# Altium schematic sheet Power Distribution - Front Enclosure.SchDoc: Outputs to Front Enclosure
size Letter; Organization: Midnight Sun Solar Rayce Car Team; Address1: University of Waterloo; Address2: 200 University Ave W; Address3: Waterloo, ON, Canada; Address4: N2L 3E9; DocumentNumber: 6; SheetNumber: 6; SheetTotal: 10; Website: www.uwmidsun.com
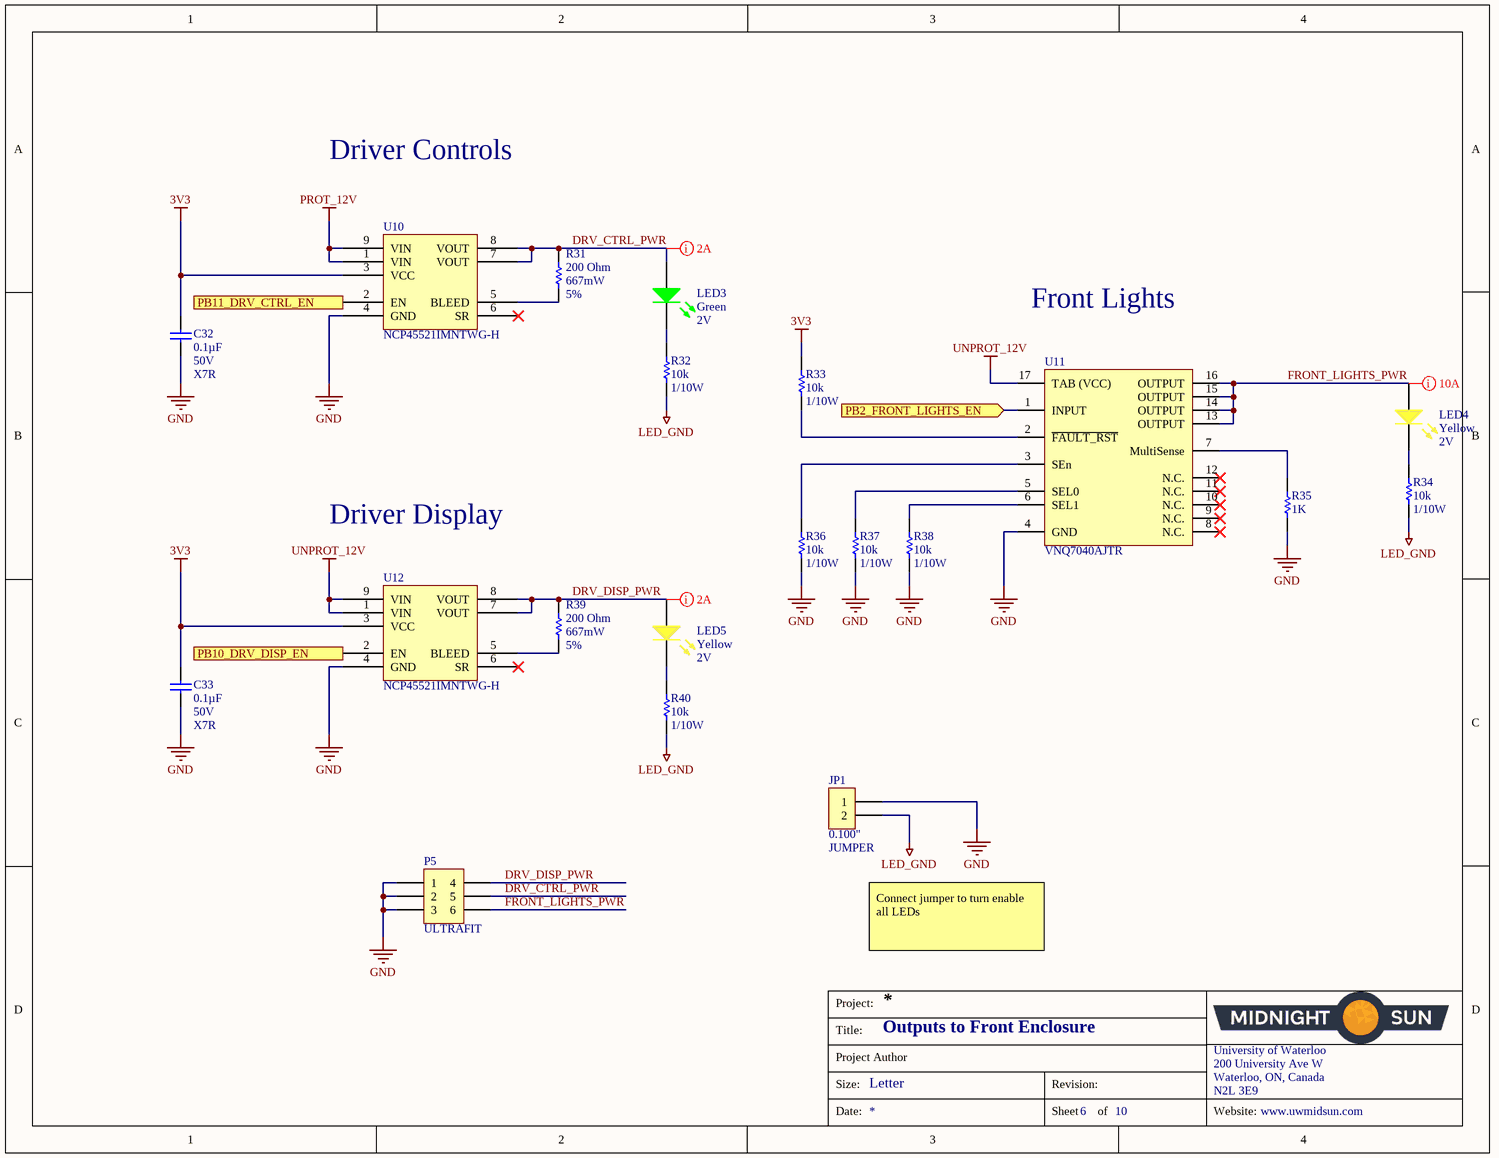
[diagram p0: Power Distribution - Front Enclosure.SchDoc]

## Parts
C32  Capacitance: 0.1µF  Voltage: 50V  Temperature Coefficient: X7R  [CAP, 0603]  (hidden comment: CAP CER 0.1UF 50V 10% X7R 0603)
C33  Capacitance: 0.1µF  Voltage: 50V  Temperature Coefficient: X7R  [CAP, 0603]  (hidden comment: CAP CER 0.1UF 50V 10% X7R 0603)
JP1  Row Spacing - Mating: 0.100"  [CONN 2POS JUMPER 0.1"]  (hidden comment: JUMPER)
LED3  Color: Green  Voltage - Forward (Vf) (Typ): 2V  [LED_0603]  (hidden comment: LED GREEN CLEAR 2V 0603)
LED4  Color: Yellow  Voltage - Forward (Vf) (Typ): 2V  [LED_0603]  (hidden comment: LED YELLOW CLEAR 2.1V 0603)
LED5  Color: Yellow  Voltage - Forward (Vf) (Typ): 2V  [LED_0603]  (hidden comment: LED YELLOW CLEAR 2.1V 0603)
P5  Series: ULTRAFIT  [CONN, 6POS ULTRA-FIT]  (hidden comment: CONN 6POS ULTRA-FIT 0.138")
R31  200 Ohm  Tolerance: 5%  Max Power Dissipation: 667mW  [RES 1206]
R32  Resistance: 10k  Power: 1/10W  [RES, 0603]  (hidden comment: RES 10K OHM 1% 1/10W 0603)
R33  Resistance: 10k  Power: 1/10W  [RES, 0603]  (hidden comment: RES 10K OHM 1% 1/10W 0603)
R34  Resistance: 10k  Power: 1/10W  [RES, 0603]  (hidden comment: RES 10K OHM 1% 1/10W 0603)
R35  1K  [RES, 0603]
R36  Resistance: 10k  Power: 1/10W  [RES, 0603]  (hidden comment: RES 10K OHM 1% 1/10W 0603)
R37  Resistance: 10k  Power: 1/10W  [RES, 0603]  (hidden comment: RES 10K OHM 1% 1/10W 0603)
R38  Resistance: 10k  Power: 1/10W  [RES, 0603]  (hidden comment: RES 10K OHM 1% 1/10W 0603)
R39  200 Ohm  Tolerance: 5%  Max Power Dissipation: 667mW  [RES 1206]
R40  Resistance: 10k  Power: 1/10W  [RES, 0603]  (hidden comment: RES 10K OHM 1% 1/10W 0603)
U10  IC LOAD SWITCH ACT-HI 10.5A 8DFN  [IC LOAD SWITCH ACT-HI 10.5A 8DFN]  (value not drawn)
U11  VNQ7040AJTR  [IC DVR HIGH-SIDE 1CH POWERSSO-16]
U12  IC LOAD SWITCH ACT-HI 10.5A 8DFN  [IC LOAD SWITCH ACT-HI 10.5A 8DFN]  (value not drawn)

## Ports
PB2_FRONT_LIGHTS_EN (in), PB10_DRV_DISP_EN (in), PB11_DRV_CTRL_EN (in)

## Nets
3V3: C32.1 C33.1 R33.1 U10.3(VCC) U12.3(VCC)
GND: C32.2 C33.2 JP1.1 P5.1 P5.2 P5.3 R35.2 R36.2 R37.2 R38.2 U10.4(GND) U11.4(GND) U12.4(GND)
LED_GND: JP1.2 R32.2 R34.2 R40.2
PROT_12V: U10.1(VIN) U10.9(VIN)
UNPROT_12V: U11.17(TAB_(VCC)) U12.1(VIN) U12.9(VIN)
DRV_CTRL_PWR: LED3.1(A) P5.5 R31.1 U10.7(VOUT) U10.8(VOUT)
DRV_DISP_PWR: LED5.1(A) P5.4 R39.1 U12.7(VOUT) U12.8(VOUT)
FRONT_LIGHTS_PWR: LED4.1(A) P5.6 U11.13(OUTPUT) U11.14(OUTPUT) U11.15(OUTPUT) U11.16(OUTPUT)
PB2_FRONT_LIGHTS_EN: U11.1(INPUT) ; port PB2_FRONT_LIGHTS_EN
PB10_DRV_DISP_EN: U12.2(EN) ; port PB10_DRV_DISP_EN
PB11_DRV_CTRL_EN: U10.2(EN) ; port PB11_DRV_CTRL_EN
NetLED3_2: LED3.2(K) R32.1
NetLED4_2: LED4.2(K) R34.1
NetLED5_2: LED5.2(K) R40.1
NetR31_2: R31.2 U10.5(BLEED)
NetR33_2: R33.2 U11.2(~{FAULT_RST})
NetR35_1: R35.1 U11.7(MultiSense)
NetR36_1: R36.1 U11.3(SEn)
NetR37_1: R37.1 U11.5(SEL0)
NetR38_1: R38.1 U11.6(SEL1)
NetR39_2: R39.2 U12.5(BLEED)

Not connected (* = marked no-connect by the designer): U10 6(SR)*; U11 8(N.C.)* 9(N.C.)* 10(N.C.)* 11(N.C.)* 12(N.C.)*; U12 6(SR)*

## Layout directives
net class HighCurrent; rule Power Plane Connect Style [Style - Direct Connect]; rule Polygon Connect Style [Style - Direct Connect]: DRV_CTRL_PWR, DRV_DISP_PWR, FRONT_LIGHTS_PWR

## Notes on the sheet
- Driver Controls
- Front Lights
- Driver Display
- Connect jumper to turn enable all LEDs
- Project:
- Title:
- Size:
- Project Author
- Letter
- Revision:
- University of Waterloo
- 200 University Ave W
- Waterloo, ON, Canada
- N2L 3E9
- Date:
- Sheet
- of
- Website:

## Library data of the parts
C32 C33 = CAP CER 0.1UF 50V 10% X7R 0603: 0.10µF ±10% 50V Ceramic Capacitor X7R 0603 (1608 Metric); Manufacturer 1: AVX Corporation; Manufacturer Part Number 1: 06035C104KAT2A; Supplier 1: Digi-Key; Supplier Part Number 1: 478-5052-1-ND; Packaging: Cut Tape (CT); Part Status: Active; Operating Temperature: -55°C ~ 125°C; Ratings: -; Mounting Type: Surface Mount, MLCC; Package / Case: 0603 (1608 Metric); Size / Dimension: 0.063" L x 0.032" W (1.60mm x 0.81mm); Height - Seated (Max): -; Thickness (Max): 0.035" (0.90mm); Lead Spacing: -; Lead Style: -; ComponentLink1URL: http://datasheets.avx.com/X7RDielectric.pdf; ComponentLink1Description: http://datasheets.avx.com/X7RDielectric.pdf; Tolerance: ±10%
JP1 = CONN 2POS JUMPER 0.1": 2 Positions Header Connector Through Hole Gold; Manufacturer: Omron Electronics Inc-EMC Div; Manufacturer Part Number: XG8T-0231; Style: Board to Board or Cable; Shrouding: Unshrouded; Number of Positions: 2; Number of Positions Loaded: All; Contact Length - Mating: 0.169" (4.30mm); Contact Length - Post: 0.118" (3.00mm); Overall Contact Length: 0.386" (9.80mm); Material Flammability Rating: UL94 V-0; Current Rating: 2A; Voltage Rating: 300V; Supplier 1: Digi-Key; RoHS: RoHS Compliant; Category: Connectors, Interconnects; Stock 1: 9094; Pricing 1: 1=0.28, 10=0.265, 100=0.183, 500=0.15484, 1000=0.12668, 5000=0.11261, 10000=0.10205 (CAD); Packaging: Bulk; Part Status: Active; Connector Type: Header; Contact Type: Male Pin; Pitch - Mating: -; Number of Rows: 2; Mounting Type: Through Hole; Termination: Solder; Fastening Type: -; Insulation Height: 0.098" (2.50mm); Contact Shape: Square; Contact Finish - Mating: Gold; Contact Finish Thickness - Mating: 5.9µin (0.15µm); Contact Finish - Post: Tin; Contact Material: Brass, Nickel; Insulation Material: Polybutylene Terephthalate (PBT), Glass Filled; Features: -; Operating Temperature: -55°C ~ 105°C; Ingress Protection: -; Insulation Color: Black; Mated Stacking Heights: -; Contact Finish Thickness - Post: -; Applications: -; ComponentLink1URL: http://www.omron.com/ecb/products/pdf/en-xj8.pdf; ComponentLink1Description: http://www.omron.com/ecb/products/pdf/en-xj8.pdf; Supplier Part Number 1: XG8T-0231-ND; Type: JUMPER
LED3 = LED GREEN CLEAR 2V 0603: Green 572nm LED Indication - Discrete 2V 0603 (1608 Metric); Manufacturer: Wurth Electronics Inc.; Manufacturer Part Number: 150060VS75000; Lens Color: Colorless; Millicandela Rating: 40mcd; Lens Style/Size: Rectangle with Flat Top, 1.10mm x 0.70mm; Current - Test: 20mA; Viewing Angle: 140°; Wavelength - Dominant: 570nm; Supplier 1: Digi-Key; RoHS: RoHS Compliant; Category: Optoelectronics; Stock 1: 9408; Pricing 1: 1=0.21, 100=0.1617, 500=0.13964 (CAD); Packaging: Cut Tape (CT); Part Status: Active; Lens Transparency: Clear; Mounting Type: Surface Mount; Wavelength - Peak: 572nm; Features: -; Package / Case: 0603 (1608 Metric); Supplier Device Package: 0603; Size / Dimension: 1.60mm L x 0.80mm W; Height (Max): 0.80mm; ComponentLink1URL: http://katalog.we-online.de/led/datasheet/150060VS75000.pdf; ComponentLink1Description: http://katalog.we-online.de/led/datasheet/150060VS75000.pdf; Supplier Part Number 1: 732-4980-1-ND
LED4 LED5 = LED YELLOW CLEAR 2.1V 0603: Yellow 590nm LED Indication - Discrete 2V 0603 (1608 Metric); Manufacturer: Wurth Electronics Inc.; Manufacturer Part Number: 150060YS75000; Lens Color: Colorless; Millicandela Rating: 120mcd; Lens Style/Size: Rectangle with Flat Top, 1.10mm x 0.70mm; Current - Test: 20mA; Viewing Angle: 140°; Wavelength - Peak: 595nm; Supplier 1: Digi-Key; RoHS: RoHS Compliant; Category: Optoelectronics; Stock 1: 10523; Pricing 1: 1=0.21, 100=0.1617, 500=0.13964 (CAD); Packaging: Cut Tape (CT); Part Status: Active; Lens Transparency: Clear; Mounting Type: Surface Mount; Wavelength - Dominant: 590nm; Features: -; Package / Case: 0603 (1608 Metric); Supplier Device Package: 0603; Size / Dimension: 1.60mm L x 0.80mm W; Height (Max): 0.80mm; ComponentLink1URL: http://katalog.we-online.de/led/datasheet/150060YS75000.pdf; ComponentLink1Description: http://katalog.we-online.de/led/datasheet/150060YS75000.pdf; Supplier Part Number 1: 732-4981-1-ND
P5 = CONN 6POS ULTRA-FIT 0.138": 6 Positions Header Connector 0.138" (3.50mm) Through Hole Tin; Manufacturer 1: Molex, LLC; Manufacturer Part Number 1: 1722991106; Style: Board to Cable/Wire; Shrouding: Shrouded - 4 Wall; Number of Positions: 6; Number of Positions Loaded: All; Row Spacing - Mating: 0.181" (4.60mm); Contact Length - Post: 0.126" (3.20mm); Material Flammability Rating: UL94 V-0; Mated Stacking Heights: 26.99mm; Voltage: 400V; Supplier 1: Digi-Key; Supplier Part Number 1: WM11778-ND; Packaging: Tray; Part Status: Active; Connector Type: Header; Contact Type: Male Pin; Pitch - Mating: 0.138" (3.50mm); Number of Rows: 2; Mounting Type: Through Hole; Termination: Solder; Fastening Type: Latch Holder; Contact Length - Mating: -; Overall Contact Length: -; Insulation Height: 0.465" (11.80mm); Contact Shape: Square; Contact Finish - Mating: Tin; Contact Finish Thickness - Mating: 60µin (1.52µm); Contact Finish - Post: Tin; Contact Material: Copper Alloy; Insulation Material: Liquid Crystal Polymer (LCP); Operating Temperature: -40°C ~ 105°C; Ingress Protection: -; Insulation Color: Black; Current Rating: -; Contact Finish Thickness - Post: 60µin (1.52µm); ComponentLink1URL: http://www.molex.com/pdm_docs/sd/1722991106_sd.pdf; ComponentLink1Description: http://www.molex.com/pdm_docs/sd/1722991106_sd.pdf
R31 R39 = RES 200 OHM 5% 2/3W 1206: 200 Ohms ±5% 0.667W, 2/3W Chip Resistor 1206 (3216 Metric) Automotive AEC-Q200, Pulse Withstanding Thick Film; Manufacturer: Panasonic; Manufacturer Part Number: ERJ-P08J201V; Voltage Rating: 500V; Resistance: 200R; Power Rating: 660mW; Temperature Coefficient: 200ppm/°C; Voltage Rating (DC): 200V; Supplier 1: Digi-Key; Stock 1: 32165; Pricing 1: 1=0.16, 10=0.137, 100=0.0534, 1000=0.02237, 2500=0.02051 (USD); Mount: Surface Mount; Case/Package: 1206; Case Code (Imperial): 1206; Case Code (Metric): 3216; Contact Plating: Tin; Min Operating Temperature: -55°C; Max Operating Temperature: 155°C; Packaging: Tape and Reel; Package Quantity: 1; Termination: SMD/SMT; Composition: Thick Film; Number of Terminations: 2; Length: 3.2mm; Height: 0.028inch; Width: 1.6mm; Radiation Hardening: No; Lead Free: Contains Lead; ComponentLink1URL: https://datasheet.ciiva.com/17207/aoa0000ce4-17207029.pdf; ComponentLink1Description: https://datasheet.ciiva.com/17207/aoa0000ce4-17207029.pdf; ComponentLink2URL: https://datasheet.ciiva.com/9184/aoa0000ce4-9184599.pdf; ComponentLink2Description: https://datasheet.ciiva.com/9184/aoa0000ce4-9184599.pdf; ComponentLink3URL: https://datasheet.ciiva.com/9184/aoa0000ce4-9184603.pdf; ComponentLink3Description: https://datasheet.ciiva.com/9184/aoa0000ce4-9184603.pdf; ComponentLink4URL: https://datasheet.ciiva.com/30201/aoa0000ce4-30201485.pdf; ComponentLink4Description: https://datasheet.ciiva.com/30201/aoa0000ce4-30201485.pdf; Supplier Part Number 1: P200ALCT-ND
R32-R34 R36-R38 R40 = RES 10K OHM 1% 1/10W 0603: RES SMD 10K OHM 1% 1/10W 0603; Manufacturer 1: Yageo; Manufacturer Part Number 1: RC0603FR-0710KL; Temperature Coefficient: ±100ppm/°C; Supplier 1: Digi-Key; Supplier Part Number 1: 311-10.0KHRCT-ND; Packaging: Cut Tape (CT); Part Status: Active; Composition: Thick Film; Operating Temperature: -55°C ~ 155°C; Package / Case: 0603 (1608 Metric); Supplier Device Package: 0603; Size / Dimension: 0.063" L x 0.031" W (1.60mm x 0.80mm); Height - Seated (Max): 0.022" (0.55mm); Failure Rate: -; ComponentLink1URL: http://www.yageo.com/documents/recent/PYu-RC_Group_51_RoHS_L_7.pdf; ComponentLink1Description: http://www.yageo.com/documents/recent/PYu-RC_Group_51_RoHS_L_7.pdf; Tolerance: ±1%
R35 = RES 1K OHM 5% 1/10W 0603: 1k Ohm ±5% 0.1W, 1/10W Chip Resistor 0603 (1608 Metric); Manufacturer: Yageo; Manufacturer Part Number: RC0603JR-071KL; Temperature Coefficient: ±100ppm/°C; Supplier 1: Digi-Key; Supplier Part Number 1: 311-1.0KGRCT-ND; RoHS: RoHS Compliant; Category: Resistors; Stock 1: 4415240; Pricing 1: 1=0.15, 10=0.017, 100=0.0071, 1000=0.0032, 2500=0.00278 (CAD); Packaging: Cut Tape (CT); Part Status: Active; Resistance (Ohms): 1k; Tolerance: ±5%; Power (Watts): 0.1W, 1/10W; Composition: Thick Film; Features: Moisture Resistant; Operating Temperature: -55°C ~ 155°C; Package / Case: 0603 (1608 Metric); Supplier Device Package: 0603; Size / Dimension: 0.063" L x 0.031" W (1.60mm x 0.80mm); Height - Seated (Max): 0.022" (0.55mm); Failure Rate: -; ComponentLink1URL: http://www.yageo.com/documents/recent/PYu-RC_Group_51_RoHS_L_7.pdf; ComponentLink1Description: http://www.yageo.com/documents/recent/PYu-RC_Group_51_RoHS_L_7.pdf
U10 U12 = IC LOAD SWITCH ACT-HI 10.5A 8DFN: NCP45521IMNTWG-H; Manufacturer: ON Semiconductor; Switch Type: General Purpose; Number of Outputs: 1; Ratio - Input:Output: 1:1; Output Configuration: High Side; Output Type: N-Channel; Interface: On/Off; Voltage - Load: 0.5 V ~ 13.5 V; Voltage - Supply (Vcc/Vdd): 3 V ~ 5.5 V; Rds On (Typ): 12.8 mOhm; Input Type: Non-Inverting; Fault Protection: Over Temperature, UVLO; Manufacturer Part Number: NCP45521IMNTWG-H; RoHS: RoHS Compliant; Category: Integrated Circuits (ICs); Packaging: Digi-Reel®; Part Status: Active; Current - Output (Max): 10.5A; Features: Slew Rate Controlled; Operating Temperature: -40°C ~ 85°C (TA); Package / Case: 8-VFDFN Exposed Pad; Supplier Device Package: 8-DFN (2x2); ComponentLink1URL: http://www.onsemi.com/pub/Collateral/NCP45520-D.PDF; ComponentLink1Description: http://www.onsemi.com/pub/Collateral/NCP45520-D.PDF; Supplier 1: Digi-Key; Stock 1: 2377; Pricing 1: 1=1.57, 10=1.405, 100=1.0957, 500=0.90518, 1000=0.71462 (CAD); Supplier 2: Digi-Key; Stock 2: 2211; Pricing 2: 1=1.53, 10=1.372, 100=1.0702, 500=0.88408, 1000=0.69797 (CAD); Supplier Part Number 2: NCP45521IMNTWG-HOSDKR-ND
U11 = IC DVR HIGH-SIDE 1CH POWERSSO-16: IC, High Side Drive, 4V - 28V, 24A, 40 mOhm; Manufacturer 1: STMicroelectronics; Manufacturer Part Number 1: VN7040AJTR; Description 1: ABD VIPOWER; Number of Outputs: 1; Interface: On/Off; Fault Protection: Over Voltage,Over Temperature; Supplier 1: Digi-Key; Supplier Part Number 1: 497-15853-1-ND; Stock 1: 1308; Pricing 1: 1=1.82, 10=1.638, 100=1.3165, 500=1.0816, 1000=0.8962 (USD); Number of Pins: 16; Min Operating Temperature: -40°C; Max Operating Temperature: 150°C; Packaging: Tape and Reel; Max Output Current: 24A; Lead Free: Lead Free; ComponentLink1URL: http://www.mouser.com/ds/2/389/vn7040aj-957413.pdf; ComponentLink1Description: http://www.mouser.com/ds/2/389/vn7040aj-957413.pdf; ComponentLink2URL: http://www.st.com/content/ccc/resource/technical/document/datasheet/5f/e6/42/6c/dc/d9/4c/65/DM00157100.pdf/files/DM00157100.pdf/jcr:content/translations/en.DM00157100.pdf; ComponentLink2Description: http://www.st.com/content/ccc/resource/technical/document/datasheet/5f/e6/42/6c/dc/d9/4c/65/DM00157100.pdf/files/DM00157100.pdf/jcr:content/translations/en.DM00157100.pdf